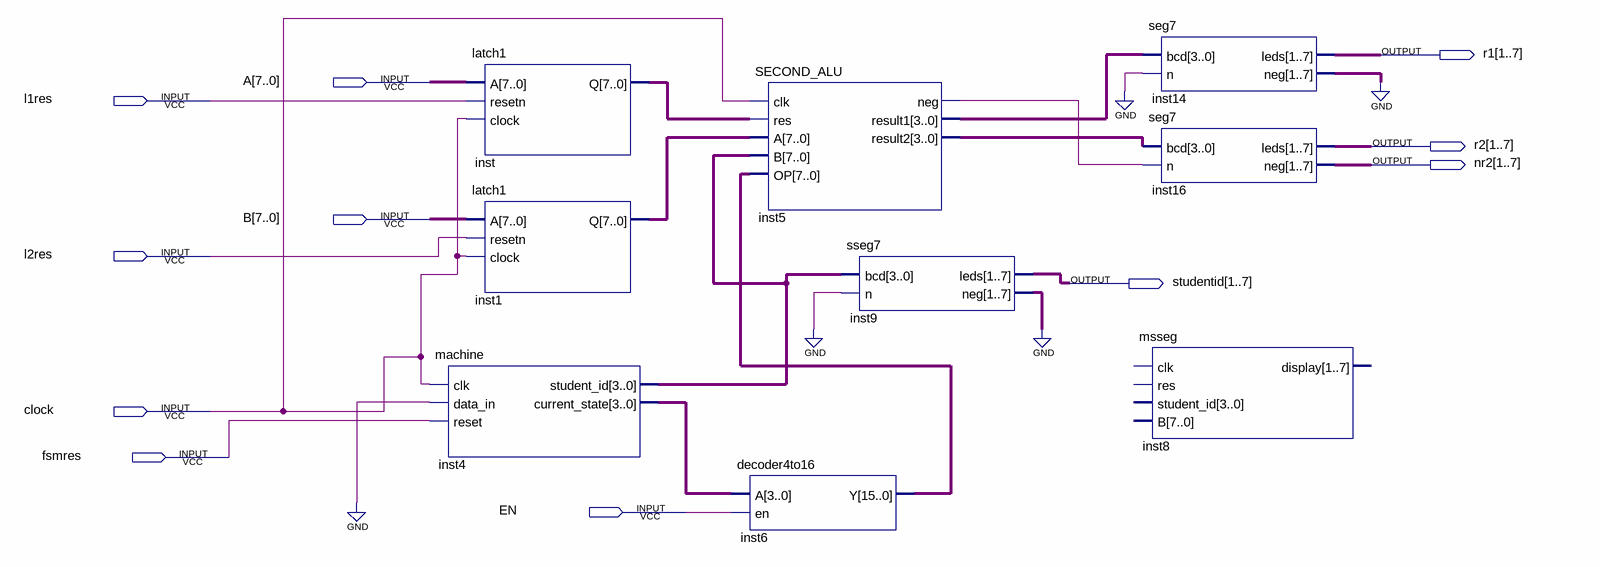
[diagram p0: schematic sheet]
// Quartus schematic gpul.bdf as structural Verilog: 9 symbols, 11 pins
module gpul (
  input  [7:0] A,
  input  l1res,
  input  [7:0] B,
  input  l2res,
  input  clock,
  input  fsmres,
  input  EN,
  output [1:7] r1,
  output [1:7] r2,
  output [1:7] nr2,
  output [1:7] studentid
);

  wire inst5_neg;
  wire [3:0] inst4_current_state, inst5_result1, inst5_result2;
  wire [6:0] inst9_neg, inst14_neg;
  wire [7:0] inst1_q, inst4_student_id, inst_q;
  wire [15:0] inst6_y;

  machine inst4 (
    .clk(clock), .data_in(1'b0), .reset(fsmres), .student_id(inst4_student_id),
    .current_state(inst4_current_state));
  latch1 inst (.A(A), .resetn(l1res), .clock(clock), .Q(inst_q));
  latch1 inst1 (.A(B), .resetn(l2res), .clock(clock), .Q(inst1_q));
  decoder4to16 inst6 (.A(inst4_current_state), .en(EN), .Y(inst6_y));
  SECOND_ALU inst5 (
    .clk(clock), .res(inst_q), .A(inst1_q), .B(inst4_student_id), .OP(inst6_y), .neg(inst5_neg),
    .result1(inst5_result1), .result2(inst5_result2));
  sseg7 inst9 (.bcd(inst4_student_id), .n(1'b0), .leds(studentid), .neg(inst9_neg));
  seg7 inst14 (.bcd(inst5_result1), .n(1'b0), .leds(r1), .neg(inst14_neg));
  seg7 inst16 (.bcd(inst5_result2), .n(inst5_neg), .leds(r2), .neg(nr2));
  msseg inst8 ();  // open: clk, res, student_id, B, display
  // also tied to GND on the sheet: {inst14_neg[0], inst14_neg[1], inst14_neg[2], inst14_neg[3], inst14_neg[4], inst14_neg[5], inst14_neg[6], inst9_neg[0], inst9_neg[1], inst9_neg[2], inst9_neg[3], inst9_neg[4], inst9_neg[5], inst9_neg[6]}
endmodule
